# Altium schematic sheet FIT_TCM_RJ45.SchDoc: FIT_PM12 board
size 420 x 297 mm; CheckedBy: G.Kasprowicz; Author: INR Moscow; CompanyName: WUT ISE; DrawnBy: M.Podgórski; Organization: WUT ISE; Address1: PW ISE; Address2: Nowowiejska 15/19 00-665 Warsaw; Address3: gkasprow@gmail.com; Revision: 2; SheetNumber: -; SheetTotal: -; ModifiedBy: -; CheckedDate: -; Title2: Title 2; DivGrp: WUT ISE; Designer: INR RAS; ModifiedDate: -; ProjectName: Sensor Box
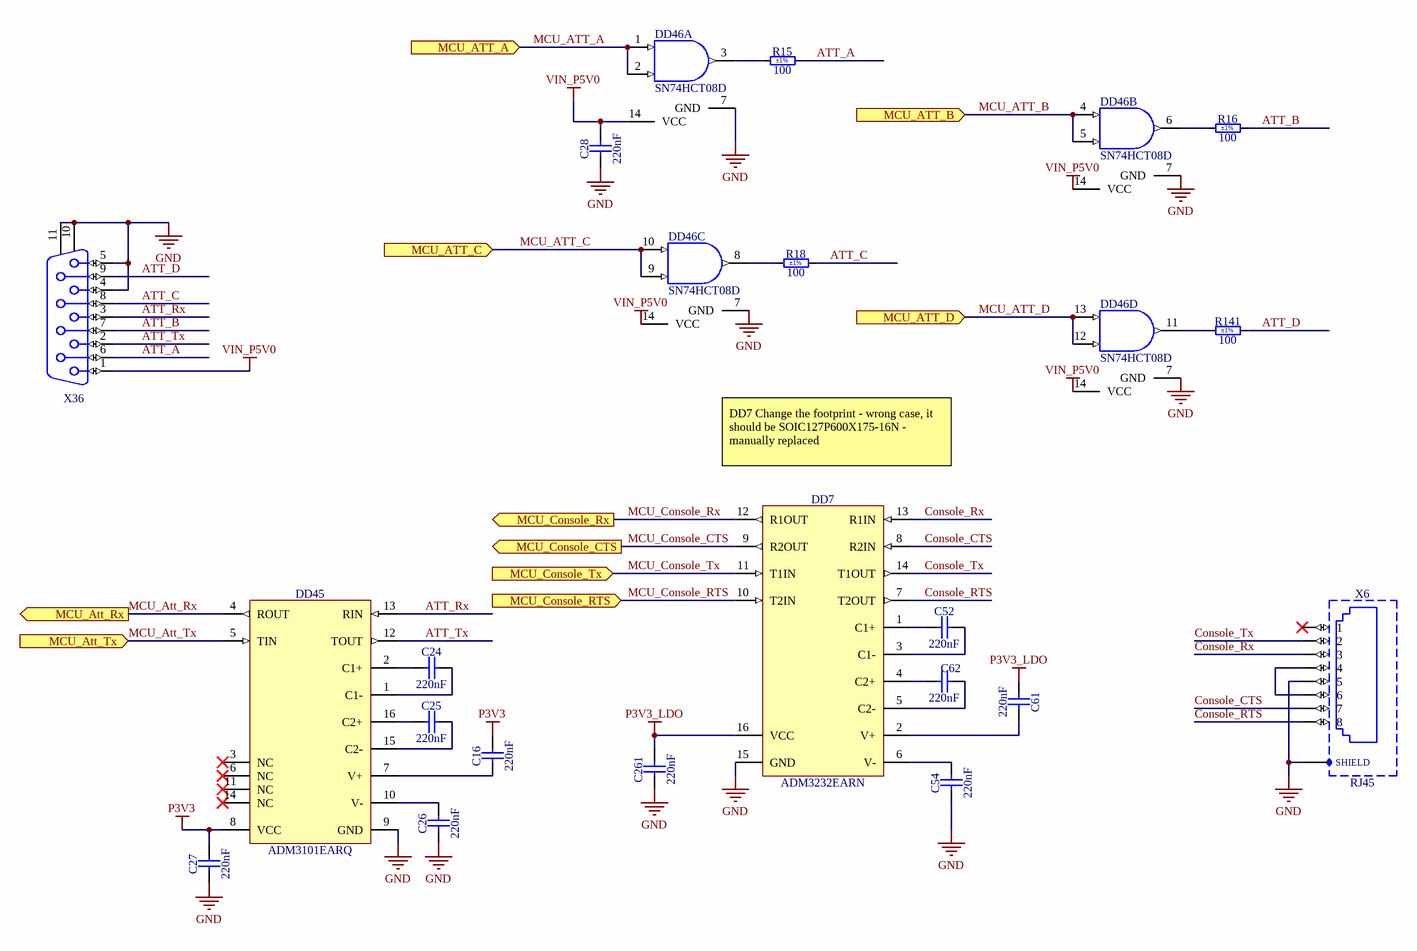
[diagram p0: FIT_TCM_RJ45.SchDoc]

## Parts
C16  220nF  [CAPC2012X135N]
C24  220nF  [CAPC2012X135N]
C25  220nF  [CAPC2012X135N]
C26  220nF  [CAPC2012X135N]
C27  220nF  [CAPC2012X135N]
C28  220nF  [CAPC2012X135N]
C52  220nF  [CAPC2012X135N]
C54  220nF  [CAPC2012X135N]
C61  220nF  [CAPC2012X135N]
C62  220nF  [CAPC2012X135N]
C261  220nF  [CAPC2012X135N]
DD7  ADM3232EARN  [SOIC127P600X175-16N]
DD45  ADM3101EARQ  [SOP63P600X175-16N]
DD46  SN74HCT08D  [SOIC127P600X175-14N]  (parts A,B,C,D of 4)
R15  100  Tolerance: ±1%  [RESC2012X60N]
R16  100  Tolerance: ±1%  [RESC2012X60N]
R18  100  Tolerance: ±1%  [RESC2012X60N]
R141  100  Tolerance: ±1%  [RESC2012X60N]
X6  RJ45  [AMPHENOL_RJLSE4238101]
X36  D-Sub 9F  [HARTING_09 66 152 6612]  (value not drawn)

## Ports
MCU_ATT_A (in), MCU_ATT_B (in), MCU_ATT_C (in), MCU_ATT_D (in), MCU_Att_Rx (out), MCU_Att_Tx (in), MCU_Console_CTS (out), MCU_Console_RTS (in), MCU_Console_Rx (out), MCU_Console_Tx (in)

## Nets
GND: C26.1 C27.1 C28.1 C54.1 C261.1 DD7.15(GND) DD45.9(GND) DD46.7(GND) X6.5 X6.SHIELD X36.4 X36.5 X36.10 X36.11
P3V3: C16.2 C27.2 DD45.8(VCC)
P3V3_LDO: C61.1 C261.2 DD7.16(VCC)
VIN_P5V0: C28.2 DD46.14(VCC) X36.1
ATT_A: R15.2 X36.6
ATT_B: R16.2 X36.7
ATT_C: R18.2 X36.8
ATT_D: R141.2 X36.9
ATT_Rx: DD45.13(RIN) X36.3
ATT_Tx: DD45.12(TOUT) X36.2
Console_CTS: DD7.8(R2IN) X6.7
Console_RTS: DD7.7(T2OUT) X6.8
Console_Rx: DD7.13(R1IN) X6.3
Console_Tx: DD7.14(T1OUT) X6.2
MCU_ATT_A: DD46.1(A) DD46.2(B) ; port MCU_ATT_A
MCU_ATT_B: DD46.4(A) DD46.5(B) ; port MCU_ATT_B
MCU_ATT_C: DD46.9(B) DD46.10(A) ; port MCU_ATT_C
MCU_ATT_D: DD46.12(B) DD46.13(A) ; port MCU_ATT_D
MCU_Att_Rx: DD45.4(ROUT) ; port MCU_Att_Rx
MCU_Att_Tx: DD45.5(TIN) ; port MCU_Att_Tx
MCU_Console_CTS: DD7.9(R2OUT) ; port MCU_Console_CTS
MCU_Console_RTS: DD7.10(T2IN) ; port MCU_Console_RTS
MCU_Console_Rx: DD7.12(R1OUT) ; port MCU_Console_Rx
MCU_Console_Tx: DD7.11(T1IN) ; port MCU_Console_Tx
NetC16_1: C16.1 DD45.7(V+)
NetC24_1: C24.1 DD45.2(C1+)
NetC24_2: C24.2 DD45.1(C1-)
NetC25_1: C25.1 DD45.16(C2+)
NetC25_2: C25.2 DD45.15(C2-)
NetC26_2: C26.2 DD45.10(V-)
NetC52_1: C52.1 DD7.1(C1+)
NetC52_2: C52.2 DD7.3(C1-)
NetC54_2: C54.2 DD7.6(V-)
NetC61_2: C61.2 DD7.2(V+)
NetC62_1: C62.1 DD7.4(C2+)
NetC62_2: C62.2 DD7.5(C2-)
NetDD46_3: DD46.3(Y) R15.1
NetDD46_6: DD46.6(Y) R16.1
NetDD46_8: DD46.8(Y) R18.1
NetDD46_11: DD46.11(Y) R141.1
NetX6_4: X6.4 X6.6

Not connected (* = marked no-connect by the designer): DD45 3(NC)* 6(NC)* 11(NC)* 14(NC)*; X6 1*

## Notes on the sheet
- DD7 Change the footprint - wrong case, it should be SOIC127P600X175-16N - manually replaced
- Project/Equipment
- Document
- Designer
- Drawn by
- Check.by
- Copyright WUT ISE 2024.
  This documentation describes Open Hardware and is licensed under the CERN OHL v.2. You may redistribute and modify this documentation under the terms of the CERN OHL v.2. (http://ohwr.org/CERNOHL). This documentation is distributed WITHOUT ANY EXPRESS OR IMPLIED WARRANTY, INCLUDING OF MERCHANTABILITY, SATISFACTORY QUALITY AND FITNESS FOR A PARTICULAR PURPOSE. Please see the CERN OHL v.2 for applicable conditions.
- Contact
- File
- Last Mod.
- Print Date
- Sheet
- Size
- A3
- of
- Rev

## Library data of the parts
C16 C24-C28 C52 C54 C61 C62 C261 = CC0805_220NF_50V_10%_X7R: Non-polarised capacitor; Part Description: SMD Multilayer Chip Ceramic Capacitor; Manufacturer: GENERIC; Manufacturer1 Part Number: GRM21BR71H224KA01L; Voltage: 50V; TC: X7R; Tolerance: ±10%; Part Number: CC0805_220NF_50V_10%_X7R; Component Kind: Standard; Component Type: Standard; Pin Count: 2; Value: 220nF; Status: Preferred; Manufacturer Part Number: CC0805_220NF_50V_10%_X7R; Case: 0805; Mounted: Yes; Socket: No; SMD: Yes; Sense: No; Manufacturer1 Example: MURATA; Manufacturer1 ComponentHeight: 1.35mm; HelpURL: \\cern.ch\dfs\Applications\Altium\Datasheets\CC0805_X7R_MURATA.pdf; Author: CERN DEM JLC; CreateDate: 03.12.2007; LatestRevisionDate: 03.12.2007
DD7 = ADM3232EARN: ±15 kV ESD Protected, 3.3 V, RS-232 Line Driver/Receiver; Manufacturer: ANALOG DEVICES; PressFit: No; Bonding: No; Part Number: ADM3232EARN; Component Kind: Standard; Component Type: Standard; Device: ADM3232EARN; Footprint: SOIC127P1032X265-16N; PackageDescription: SOIC, 1.27mm Pitch; 16 pin, 7.50mm W X 10.4mm L X 2.65mm H body, IPC Medium Density; Part Description: ±15 kV ESD Protected, 3.3 V, RS-232 Line Driver/Receiver; Manufacturer Part Number: ADM3232EARN; Pin Count: 16; Case: SOIC16; Mounted: Yes; Socket: No; SMD: Yes; Sense: No; ComponentHeight: 2.65mm; Author: CERN DEM HF; HelpURL: \\cern.ch\dfs\Applications\Altium\Datasheets\ADM3232EARN.pdf; CreateDate: 24.05.2024; LatestRevisionDate: 24.05.2024
DD45 = ADM3101EARQ: ±15 kV ESD Protected, 3.3 V Single-Channel RS-232 Line Driver/Receiver; Manufacturer: ANALOG DEVICES; PressFit: No; Bonding: No; Part Number: ADM3101EARQ; Component Kind: Standard; Component Type: Standard; Device: ADM3101EARQ; PackageDescription: SOP, 0.635mm Pitch; 16 Pin, 3.9mm W X 4.895mm L X 1.75mm H body, IPC Medium Density; Part Description: ±15 kV ESD Protected, 3.3 V Single-Channel RS-232 Line Driver/Receiver; Manufacturer Part Number: ADM3101EARQ; Pin Count: 16; Case: SSOP16; Mounted: Yes; Socket: No; SMD: Yes; Sense: No; ComponentHeight: 1.75mm; Author: CERN DEM HF; HelpURL: \\cern.ch\dfs\Applications\Altium\Datasheets\ADM3101EARQ.pdf; CreateDate: 08.05.2024; LatestRevisionDate: 08.05.2024
DD46 = SN74HCT08D: Quad 2-Input AND Gate; Part Description: Quadruple 2-Input Positive-AND Gate; Manufacturer: TEXAS INSTRUMENTS; PressFit: No; Bonding: No; Part Number: SN74HCT08D; Component Kind: Standard; Component Type: Standard; Device: SN74HCT08D; PackageDescription: SOIC, 1.27mm Pitch; 14 Pin, 4.00mm W X 8.75mm L X 1.75mm H body, IPC Medium Density; Manufacturer Part Number: SN74HCT08D; Pin Count: 14; Case: SOIC14; Mounted: Yes; Socket: No; SMD: Yes; Sense: No; ComponentHeight: 1.75mm; Author: CERN DEM HF; HelpURL: \\cern.ch\dfs\Applications\Altium\Datasheets\SN74HCT08.pdf; CreateDate: 10.06.2024; LatestRevisionDate: 10.06.2024
R15 R16 R18 R141 = R0805_100R_1%_0.125W_100PPM: Resistor - 1%; Part Description: General Purpose Thick Film Chip Resistor; Manufacturer: GENERIC; Manufacturer1 Part Number: NRC10F4700TRF; Power: 0.125W; TC: ±100ppm/°C; PressFit: No; Part Number: R0805_100R_1%_0.125W_100PPM; Component Kind: Standard; Component Type: Standard; Pin Count: 2; Value: 100; Status: Preferred; Manufacturer Part Number: R0805_100R_1%_0.125W_100PPM; Case: 0805; Mounted: Yes; Sense: No; Socket: No; SMD: Yes; Manufacturer1 Example: NIC COMPONENT; Manufacturer1 ComponentHeight: 0.6mm; HelpURL: \\cern.ch\dfs\Applications\Altium\Datasheets\R0805_NIC_NRC.pdf; Author: CERN DEM JLC; CreateDate: 03.12.2007; LatestRevisionDate: 13.03.2008
X6 = AMPHENOL_RJLSE4238101: Connector RJ45 + Shield; Part Description: 1 Port RJ45 Connector, 8P8C ,  Right Angle Without Leds; PressFit: No; Part Number: AMPHENOL_RJLSE4238101; Component Kind: Standard; Component Type: Standard; Pin Count: 9; Family: RJ45; Mounted: Yes; Socket: No; SMD: No; Sense: No; Status: None; Manufacturer: AMPHENOL; Manufacturer Part Number: RJLSE4238101; ComponentHeight: 11.85mm; HelpURL: \\cern.ch\dfs\Applications\Altium\Datasheets\AMPHENOL_RJLSE4238101.pdf; Author: CERN DEM HF; CreateDate: 07.06.2024; LatestRevisionDate: 07.06.2024
X36 = HARTING_09 66 152 6612: Connector D-sub 9 Female; Part Description: Right Angled D-Sub 9 Female Contacts with Grounding Board Locks And UNC 4-40 Flange Thread; PressFit: No; Part Number: HARTING_09 66 152 6612; Component Kind: Standard; Component Type: Standard; Pin Count: 11; Family: D-Sub 9F; Mounted: Yes; Socket: No; SMD: No; Sense: No; Status: None; Manufacturer: HARTING; Manufacturer Part Number: 09 66 152 6612; ComponentHeight: 13.6mm; HelpURL: \\cern.ch\dfs\Applications\Altium\Datasheets\HARTING_09 66 152 6612.pdf; Author: CERN DEM JLC; CreateDate: 16.12.2010; LatestRevisionDate: 08.04.2013